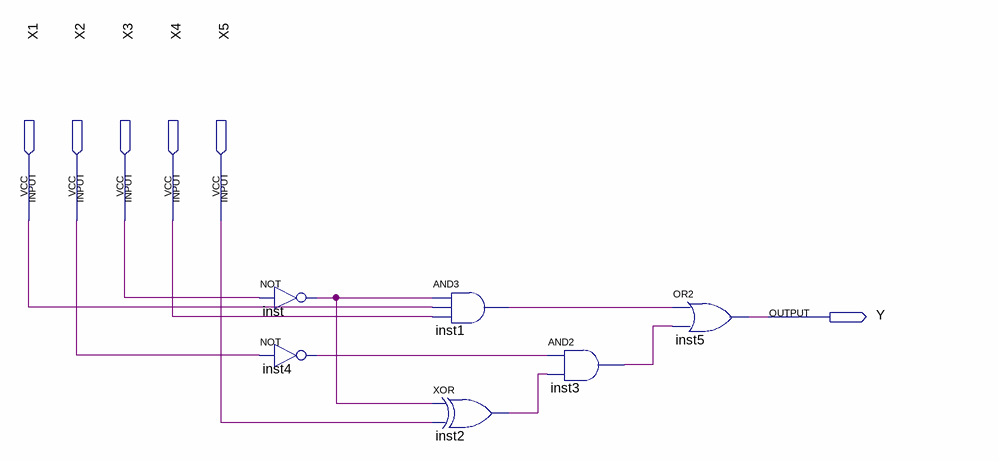
[diagram p0: schematic sheet]
// Quartus schematic part1.bdf as structural Verilog: 6 symbols, 6 pins
module part1 (
  input  X1,
  input  X2,
  input  X3,
  input  X4,
  input  X5,
  output Y
);

  wire inst1_out, inst2_out, inst3_out, inst4_out, inst_out;

  not inst (inst_out, X3);
  not inst4 (inst4_out, X2);
  and inst1 (inst1_out, inst_out, X1, X4);
  xor inst2 (inst2_out, inst_out, X5);
  and inst3 (inst3_out, inst4_out, inst2_out);
  or inst5 (Y, inst1_out, inst3_out);
endmodule
